# Altium schematic sheet S7CAS-PLEIADES-CARTE-MERE_P07_FPGA_0.SchDoc
size Tabloid; DocumentNumber: 4; SheetNumber: 4; SheetTotal: 16; Sheet_Name: FPGA_0; Size: 11x17
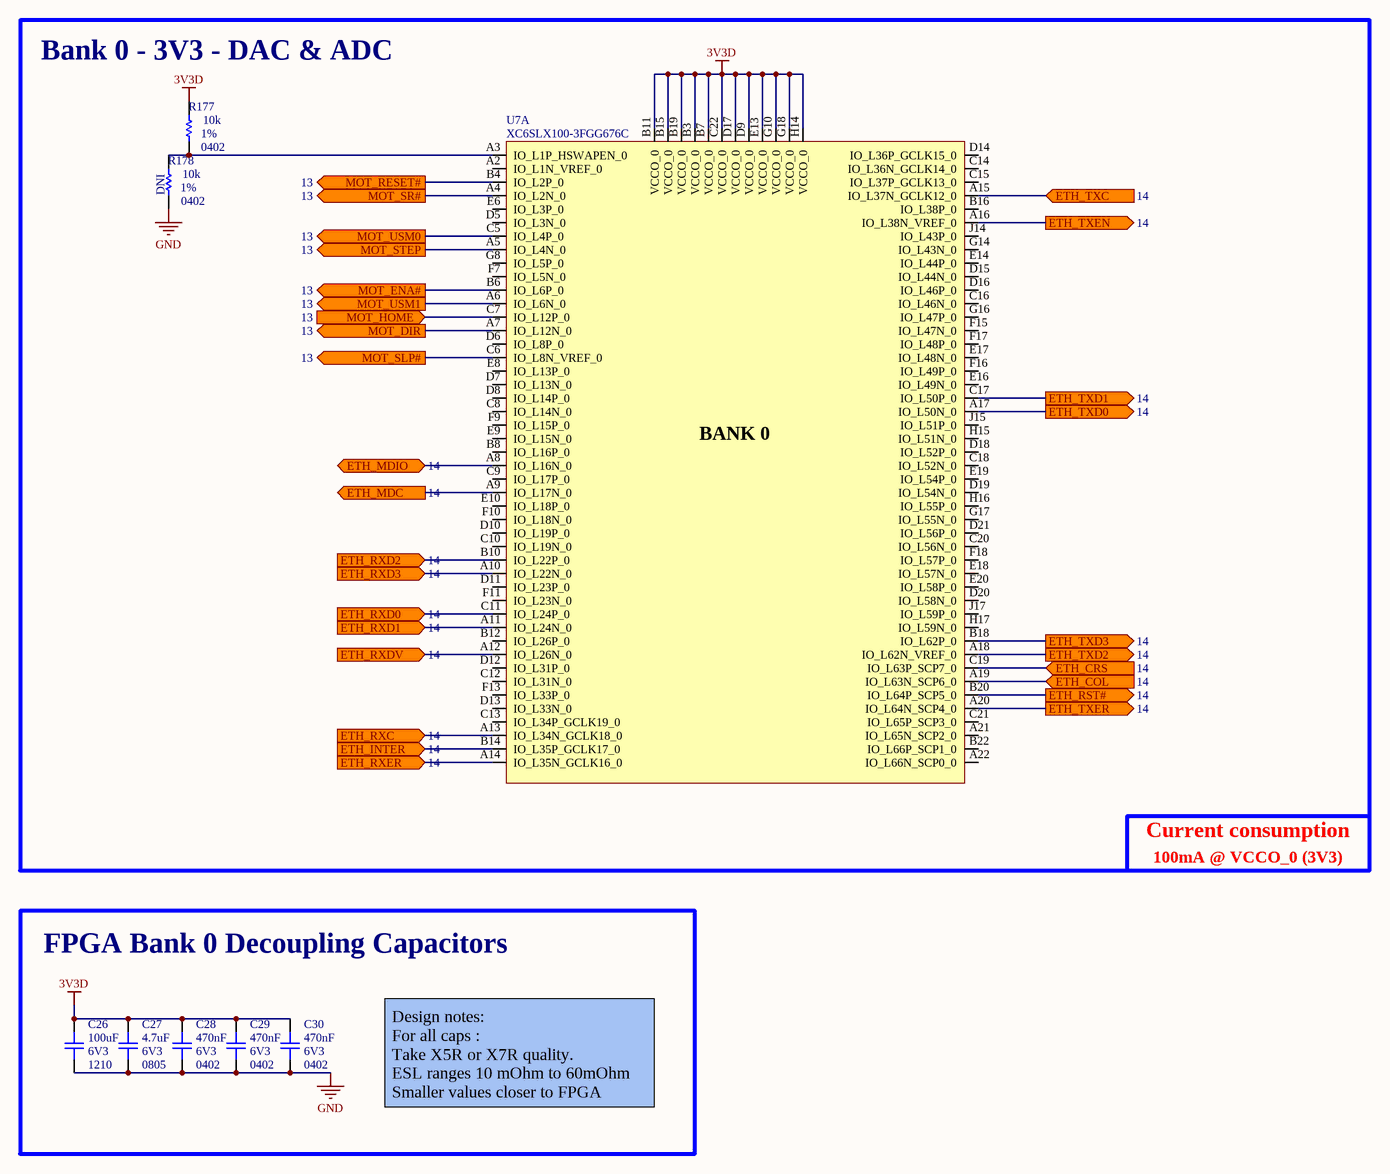
[diagram p0: S7CAS-PLEIADES-CARTE-MERE_P07_FPGA_0.SchDoc]

## Parts
C26  value 100uF  Voltage: 6V3  Package: 1210  [CAP_1210]  (hidden comment: CAP - 1210)
C27  value 4.7uF  Voltage: 6V3  Package: 0805  [CAP_0805]  (hidden comment: CAP - 0805)
C28  value 470nF  Voltage: 6V3  Package: 0402  [CAP_0402]  (hidden comment: CAP - 0402)
C29  value 470nF  Voltage: 6V3  Package: 0402  [CAP_0402]  (hidden comment: CAP - 0402)
C30  value 470nF  Voltage: 6V3  Package: 0402  [CAP_0402]  (hidden comment: CAP - 0402)
R177  value 10k  Package: 0402  Precision: 1%  [RES_0402]  (hidden comment: RES - 0402)
R178  value 10k  NI: DNI  Package: 0402  Precision: 1%  [RES_0402]  (hidden comment: RES - 0402)
U7  XC6SLX100-3FGG676C  [FPGA_XILINX_FGG676]  (part A of 10)

## Blocks framed on the sheet
Bank 0 - 3V3 - DAC & ADC: R177 R178 U7
FPGA Bank 0 Decoupling Capacitors: C26-C30

## Ports
ETH_COL (in, see 14), ETH_CRS (in, see 14), ETH_INTER (in, see 14), ETH_MDC (out, see 14), ETH_MDIO (bidir, see 14), ETH_RST# (out, see 14), ETH_RXC (in, see 14), ETH_RXD0 (in, see 14), ETH_RXD1 (in, see 14), ETH_RXD2 (in, see 14), ETH_RXD3 (in, see 14), ETH_RXDV (in, see 14), ETH_RXER (in, see 14), ETH_TXC (in, see 14), ETH_TXD0 (out, see 14), ETH_TXD1 (out, see 14), ETH_TXD2 (out, see 14), ETH_TXD3 (out, see 14), ETH_TXEN (out, see 14), ETH_TXER (out, see 14), MOT_DIR (out, see 13), MOT_ENA# (out, see 13), MOT_HOME (in, see 13), MOT_RESET# (out, see 13), MOT_SLP# (out, see 13), MOT_SR# (out, see 13), MOT_STEP (out, see 13), MOT_USM0 (out, see 13), MOT_USM1 (out, see 13)

## Nets
3V3D: C26.2 C27.2 C28.2 C29.2 C30.2 R177.2 U7.B3(VCCO_0) U7.B7(VCCO_0) U7.B11(VCCO_0) U7.B15(VCCO_0) U7.B19(VCCO_0) U7.C22(VCCO_0) U7.D9(VCCO_0) U7.D17(VCCO_0) U7.E13(VCCO_0) U7.G10(VCCO_0) U7.G18(VCCO_0) U7.H14(VCCO_0)
GND: C26.1 C27.1 C28.1 C29.1 C30.1 R178.1
ETH_COL: U7.A19(IO_L63N_SCP6_0) ; port ETH_COL
ETH_CRS: U7.C19(IO_L63P_SCP7_0) ; port ETH_CRS
ETH_INTER: U7.B14(IO_L35P_GCLK17_0) ; port ETH_INTER
ETH_MDC: U7.A9(IO_L17N_0) ; port ETH_MDC
ETH_MDIO: U7.A8(IO_L16N_0) ; port ETH_MDIO
ETH_RST#: U7.B20(IO_L64P_SCP5_0) ; port ETH_RST#
ETH_RXC: U7.A13(IO_L34N_GCLK18_0) ; port ETH_RXC
ETH_RXD0: U7.C11(IO_L24P_0) ; port ETH_RXD0
ETH_RXD1: U7.A11(IO_L24N_0) ; port ETH_RXD1
ETH_RXD2: U7.B10(IO_L22P_0) ; port ETH_RXD2
ETH_RXD3: U7.A10(IO_L22N_0) ; port ETH_RXD3
ETH_RXDV: U7.A12(IO_L26N_0) ; port ETH_RXDV
ETH_RXER: U7.A14(IO_L35N_GCLK16_0) ; port ETH_RXER
ETH_TXC: U7.A15(IO_L37N_GCLK12_0) ; port ETH_TXC
ETH_TXD0: U7.A17(IO_L50N_0) ; port ETH_TXD0
ETH_TXD1: U7.C17(IO_L50P_0) ; port ETH_TXD1
ETH_TXD2: U7.A18(IO_L62N_VREF_0) ; port ETH_TXD2
ETH_TXD3: U7.B18(IO_L62P_0) ; port ETH_TXD3
ETH_TXEN: U7.A16(IO_L38N_VREF_0) ; port ETH_TXEN
ETH_TXER: U7.A20(IO_L64N_SCP4_0) ; port ETH_TXER
MOT_DIR: U7.A7(IO_L12N_0) ; port MOT_DIR
MOT_ENA#: U7.B6(IO_L6P_0) ; port MOT_ENA#
MOT_HOME: U7.C7(IO_L12P_0) ; port MOT_HOME
MOT_RESET#: U7.B4(IO_L2P_0) ; port MOT_RESET#
MOT_SLP#: U7.C6(IO_L8N_VREF_0) ; port MOT_SLP#
MOT_SR#: U7.A4(IO_L2N_0) ; port MOT_SR#
MOT_STEP: U7.A5(IO_L4N_0) ; port MOT_STEP
MOT_USM0: U7.C5(IO_L4P_0) ; port MOT_USM0
MOT_USM1: U7.A6(IO_L6N_0) ; port MOT_USM1
NetR177_1: R177.1 R178.2 U7.A3(IO_L1P_HSWAPEN_0)

Not connected (* = marked no-connect by the designer): U7 A2(IO_L1N_VREF_0) A21(IO_L65N_SCP2_0) A22(IO_L66N_SCP0_0) B8(IO_L16P_0) B12(IO_L26P_0) B16(IO_L38P_0) B22(IO_L66P_SCP1_0) C8(IO_L14N_0) C9(IO_L17P_0) C10(IO_L19N_0) C12(IO_L31N_0) C13(IO_L34P_GCLK19_0) C14(IO_L36N_GCLK14_0) C15(IO_L37P_GCLK13_0) C16(IO_L46N_0) C18(IO_L52N_0) C20(IO_L56N_0) C21(IO_L65P_SCP3_0) D5(IO_L3N_0) D6(IO_L8P_0) D7(IO_L13N_0) D8(IO_L14P_0) D10(IO_L19P_0) D11(IO_L23P_0) D12(IO_L31P_0) D13(IO_L33N_0) D14(IO_L36P_GCLK15_0) D15(IO_L44N_0) D16(IO_L46P_0) D18(IO_L52P_0) D19(IO_L54N_0) D20(IO_L58N_0) D21(IO_L56P_0) E6(IO_L3P_0) E8(IO_L13P_0) E9(IO_L15N_0) E10(IO_L18P_0) E14(IO_L44P_0) E16(IO_L49N_0) E17(IO_L48N_0) E18(IO_L57N_0) E19(IO_L54P_0) E20(IO_L58P_0) F7(IO_L5N_0) F9(IO_L15P_0) F10(IO_L18N_0) F11(IO_L23N_0) F13(IO_L33P_0) F15(IO_L47N_0) F16(IO_L49P_0) F17(IO_L48P_0) F18(IO_L57P_0) G8(IO_L5P_0) G14(IO_L43N_0) G16(IO_L47P_0) G17(IO_L55N_0) H15(IO_L51N_0) H16(IO_L55P_0) H17(IO_L59N_0) J14(IO_L43P_0) J15(IO_L51P_0) J17(IO_L59P_0)

## Notes on the sheet
- 100mA @ VCCO_0 (3V3)
- Current consumption
- Design notes:
  For all caps :
  Take X5R or X7R quality.
  ESL ranges 10 mOhm to 60mOhm
  Smaller values closer to FPGA
- Sheet Name
- Project Title
- Global Project
- Size
- Group
- Revision
- Date
- Sheet
- of
- Filename
- Designers
- (in symbol FPGA_XC6SLX100-3FGG676C, part A) BANK 0

## Library data of the parts
C26 = CAP - 1210: Precision: 10%; Current: *; CreatedBy: Jonathan Bouchard; Power: *
C27 = CAP - 0805: Precision: 10%; Current: *; CreatedBy: Jonathan Bouchard; Power: *
C28-C30 = CAP - 0402: Precision: 10%; Current: *; CreatedBy: Jonathan Bouchard; Power: *
R177 R178 = RES - 0402: Voltage: 50V; Power: 1/16W; Current: *; CreatedBy: Jonathan Bouchard
  R177: Parameter 1: *
U7 = FPGA_XC6SLX100-3FGG676C: FPGA - XILINX SPARTAN 6 480 I/O - BGA-676; Voltage: 1.14 V ~ 1.26 V; Current: *; Power: *; Mfg: Xilinx; Mfg Part Number: XC6SLX100-3FGG676C; HelpURL: https://www.xilinx.com/support/documentation/data_sheets/ds162.pdf; CreatedBy: Jonathan Bouchard; Temperature: 0°C ~ 85°C (TJ); Value: *; Precision: *; Package: BGA-676; Supplier 1: Digikey; Supplier Part Number 1: 122-1760-ND